# EAGLE design atmel-atmega328p-led-strip-controller (EAGLE 9.2.2)
CREVISION: 1.0; DESIGNER: Mate Horvath

## Sheet 1 of 2
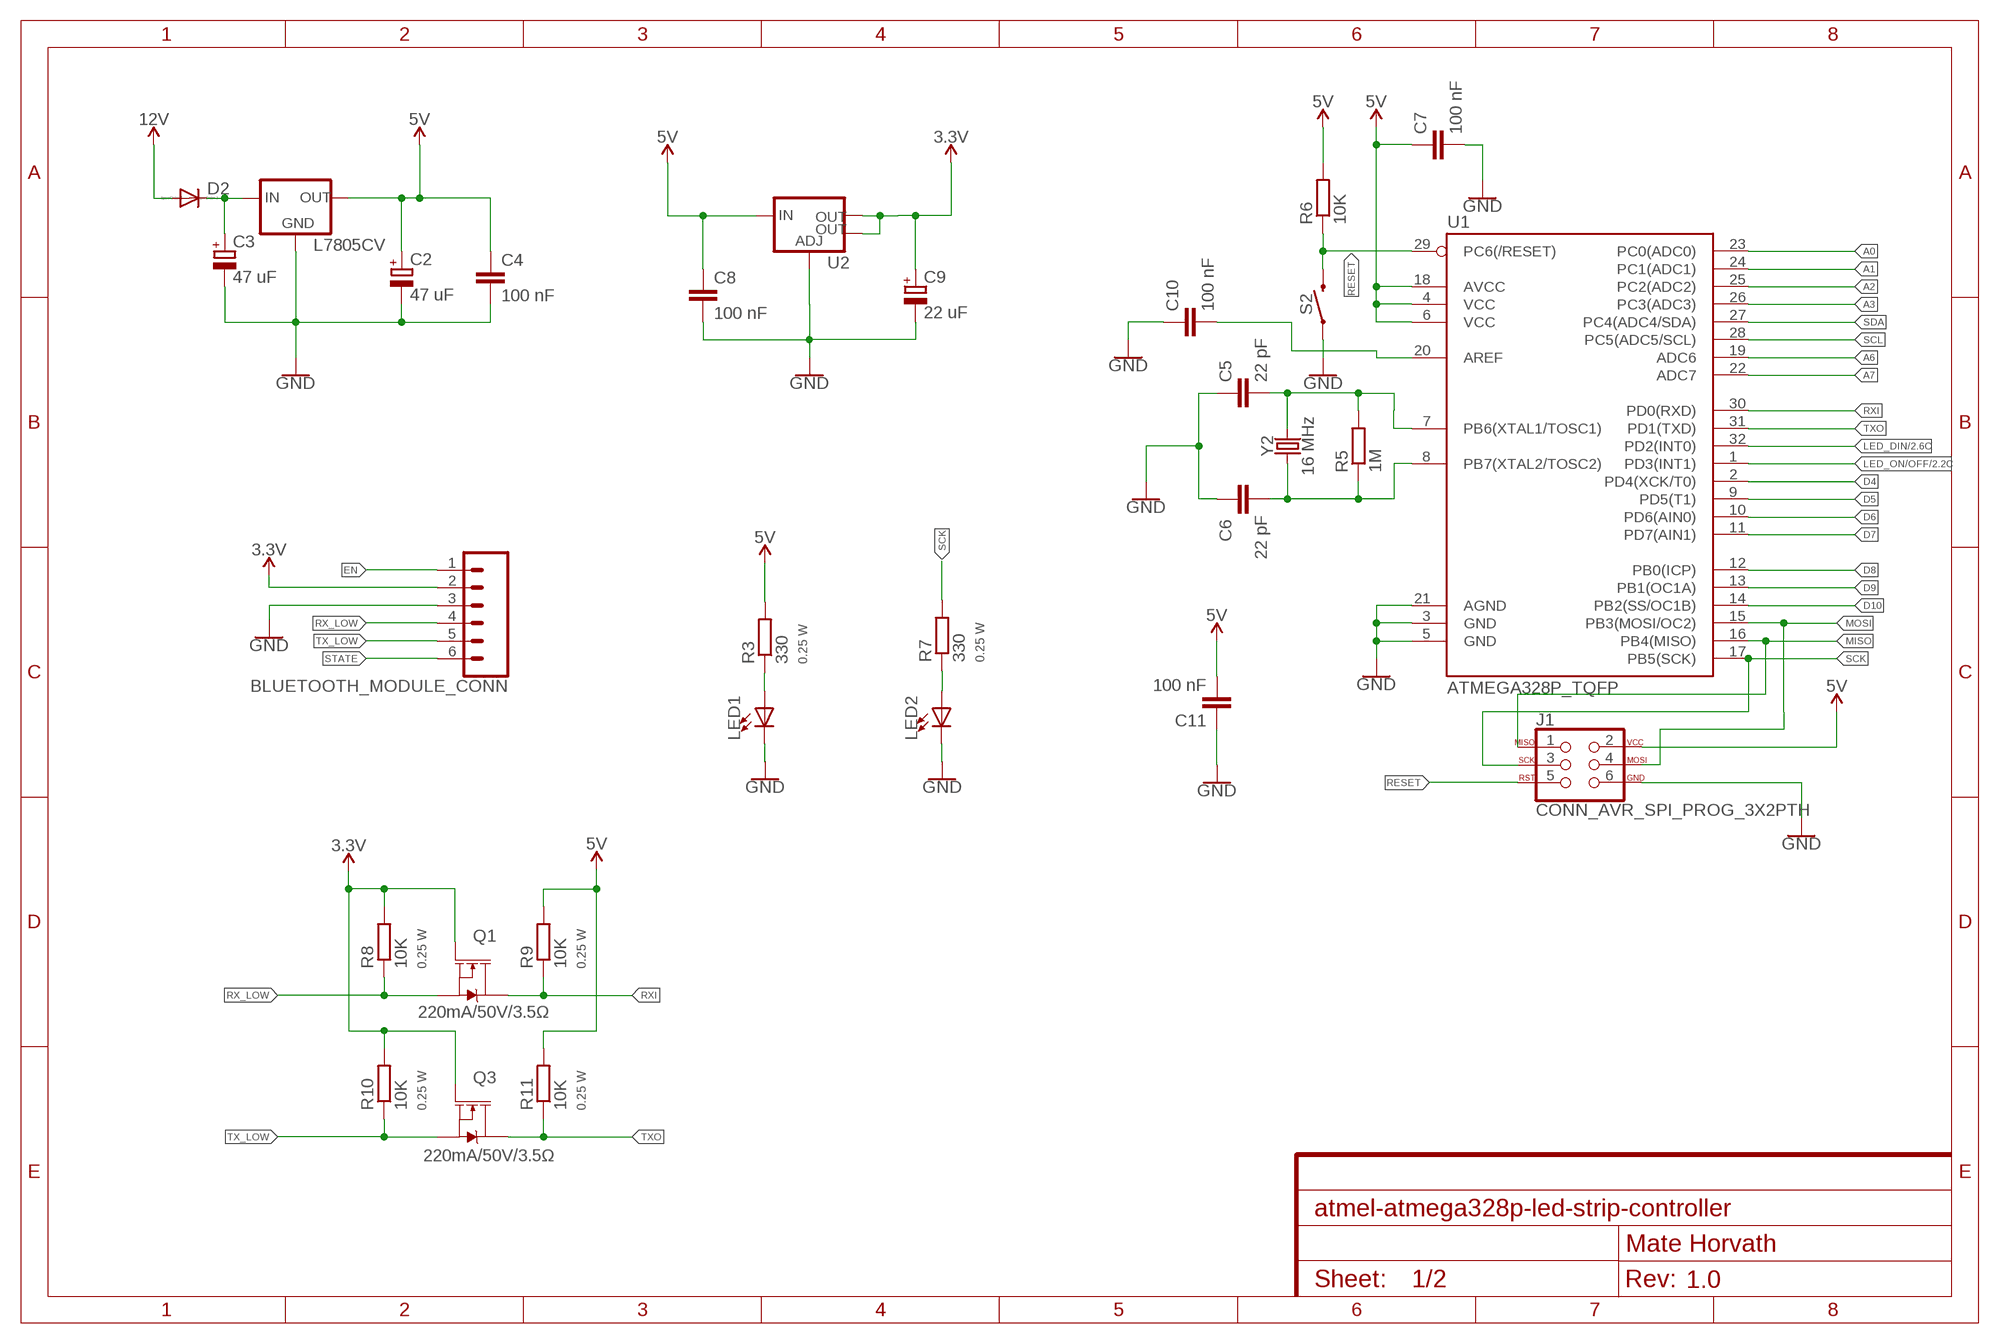
[diagram p0: schematic, sheet 1]

### Parts
BLUETOOTH_MODULE_CONN  CONN_06SILK_FEMALE_PTH  [1X06]
C2  47 uF  CAPACITOR_POLARIZEDE2.5-5  [E2,5-5]
C3  47 uF  CAPACITOR_POLARIZEDE2.5-5  [E2,5-5]
C4  100 nF  CAPACITOR_1C1206  [C1206I-C3216M]
C5  22 pF  CAPACITOR_1C1206  [C1206I-C3216M]
C6  22 pF  CAPACITOR_1C1206  [C1206I-C3216M]
C7  100 nF  CAPACITOR_1C1206  [C1206I-C3216M]
C8  100 nF  CAPACITOR_1C1206  [C1206I-C3216M]
C9  22 uF  CAPACITOR_POLARIZED153CLV-0505  [153CLV-0505]
C10  100 nF  CAPACITOR_1C1206  [C1206I-C3216M]
C11  100 nF  CAPACITOR_1C1206  [C1206I-C3216M]
D2  DIODED-10  [D-10]
J1  CONN_AVR_SPI_PROG_3X2PTH  [2X3_S]
L7805CV  V_REG_78XX_STANDING  [78XXS]
LED1  LEDCHIPLED_1206_G  [LED_1206_G]
LED2  LEDCHIPLED_1206_G  [LED_1206_G]
Q1  220mA/50V/3.5Ω  MOSFET_NCHN_SMD-BSS138  [SOT23-3]
Q3  220mA/50V/3.5Ω  MOSFET_NCHN_SMD-BSS138  [SOT23-3]
R3  330  RESISTORR1206  [R1206]
R5  1M  RESISTORR1206  [R1206]
R6  10K  RESISTORR1206  [R1206]
R7  330  RESISTORR1206  [R1206]
R8  10K  RESISTORR1206  [R1206]
R9  10K  RESISTORR1206  [R1206]
R10  10K  RESISTORR1206  [R1206]
R11  10K  RESISTORR1206  [R1206]
S2  INPUT_MOMENTARY_SWITCH_SPST-SMD-5.2MM  [TACTILE_SWITCH_SMD_5.2MM]
U1  ATMEGA328P_TQFP  MCU_ATMEGA328P_TQFP  [TQFP32-08]
U2  V_REG_LM1117SOT223  [SOT223]
Y2  16 MHz  CRYSTALSMD-3.2X2.5  [CRYSTAL-SMD-3.2X2.5MM]

### Nets
3.3V: BLUETOOTH_MODULE_CONN.2 C9.+ Q1.1(G) Q3.1(G) R8.2 R10.2 U2.2(OUT) U2.4(OUT)
5V: C2.+ C4.1 C7.1 C8.1 C11.2 J1.2 L7805CV.OUT R3.2 R6.2 R9.2 R11.2 U1.4(VCC) U1.6(VCC) U1.18(AVCC) U2.3(IN) ; also sheet 2
12V: D2.A ; also sheet 2
A0: U1.23(PC0(ADC0))
A1: U1.24(PC1(ADC1))
A2: U1.25(PC2(ADC2))
A3: U1.26(PC3(ADC3))
A6: U1.19(ADC6)
A7: U1.22(ADC7)
D4: U1.2(PD4(XCK/T0))
D5: U1.9(PD5(T1))
D6: U1.10(PD6(AIN0))
D7: U1.11(PD7(AIN1))
D8: U1.12(PB0(ICP))
D9: U1.13(PB1(OC1A))
D10: U1.14(PB2(SS/OC1B))
EN: BLUETOOTH_MODULE_CONN.1
GND: BLUETOOTH_MODULE_CONN.3 C2.- C3.- C4.2 C5.1 C6.1 C7.2 C8.2 C9.- C10.1 C11.1 J1.6 L7805CV.GND LED1.C LED2.C S2.1 U1.3(GND) U1.5(GND) U1.21(AGND) U2.1(ADJ) ; also sheet 2
LED_DIN: U1.32(PD2(INT0)) ; also sheet 2
LED_ON/OFF: U1.1(PD3(INT1)) ; also sheet 2
MISO: J1.1 U1.16(PB4(MISO))
MOSI: J1.4 U1.15(PB3(MOSI/OC2))
N$2: C5.2 R5.2 U1.7(PB6(XTAL1/TOSC1)) Y2.3
N$3: C6.2 R5.1 U1.8(PB7(XTAL2/TOSC2)) Y2.1
N$8: C10.2 U1.20(AREF)
N$11: LED1.A R3.1
N$12: C3.+ D2.C L7805CV.IN
N$13: LED2.A R7.1
RESET: J1.5 R6.1 S2.3 U1.29(PC6(/RESET))
RX_LOW: BLUETOOTH_MODULE_CONN.4 Q1.2(S) R8.1
RXI: Q1.3(D) R9.1 U1.30(PD0(RXD))
SCK: J1.3 R7.2 U1.17(PB5(SCK))
SCL: U1.28(PC5(ADC5/SCL))
SDA: U1.27(PC4(ADC4/SDA))
STATE: BLUETOOTH_MODULE_CONN.6
TX_LOW: BLUETOOTH_MODULE_CONN.5 Q3.2(S) R10.1
TXO: Q3.3(D) R11.1 U1.31(PD1(TXD))

## Sheet 2 of 2
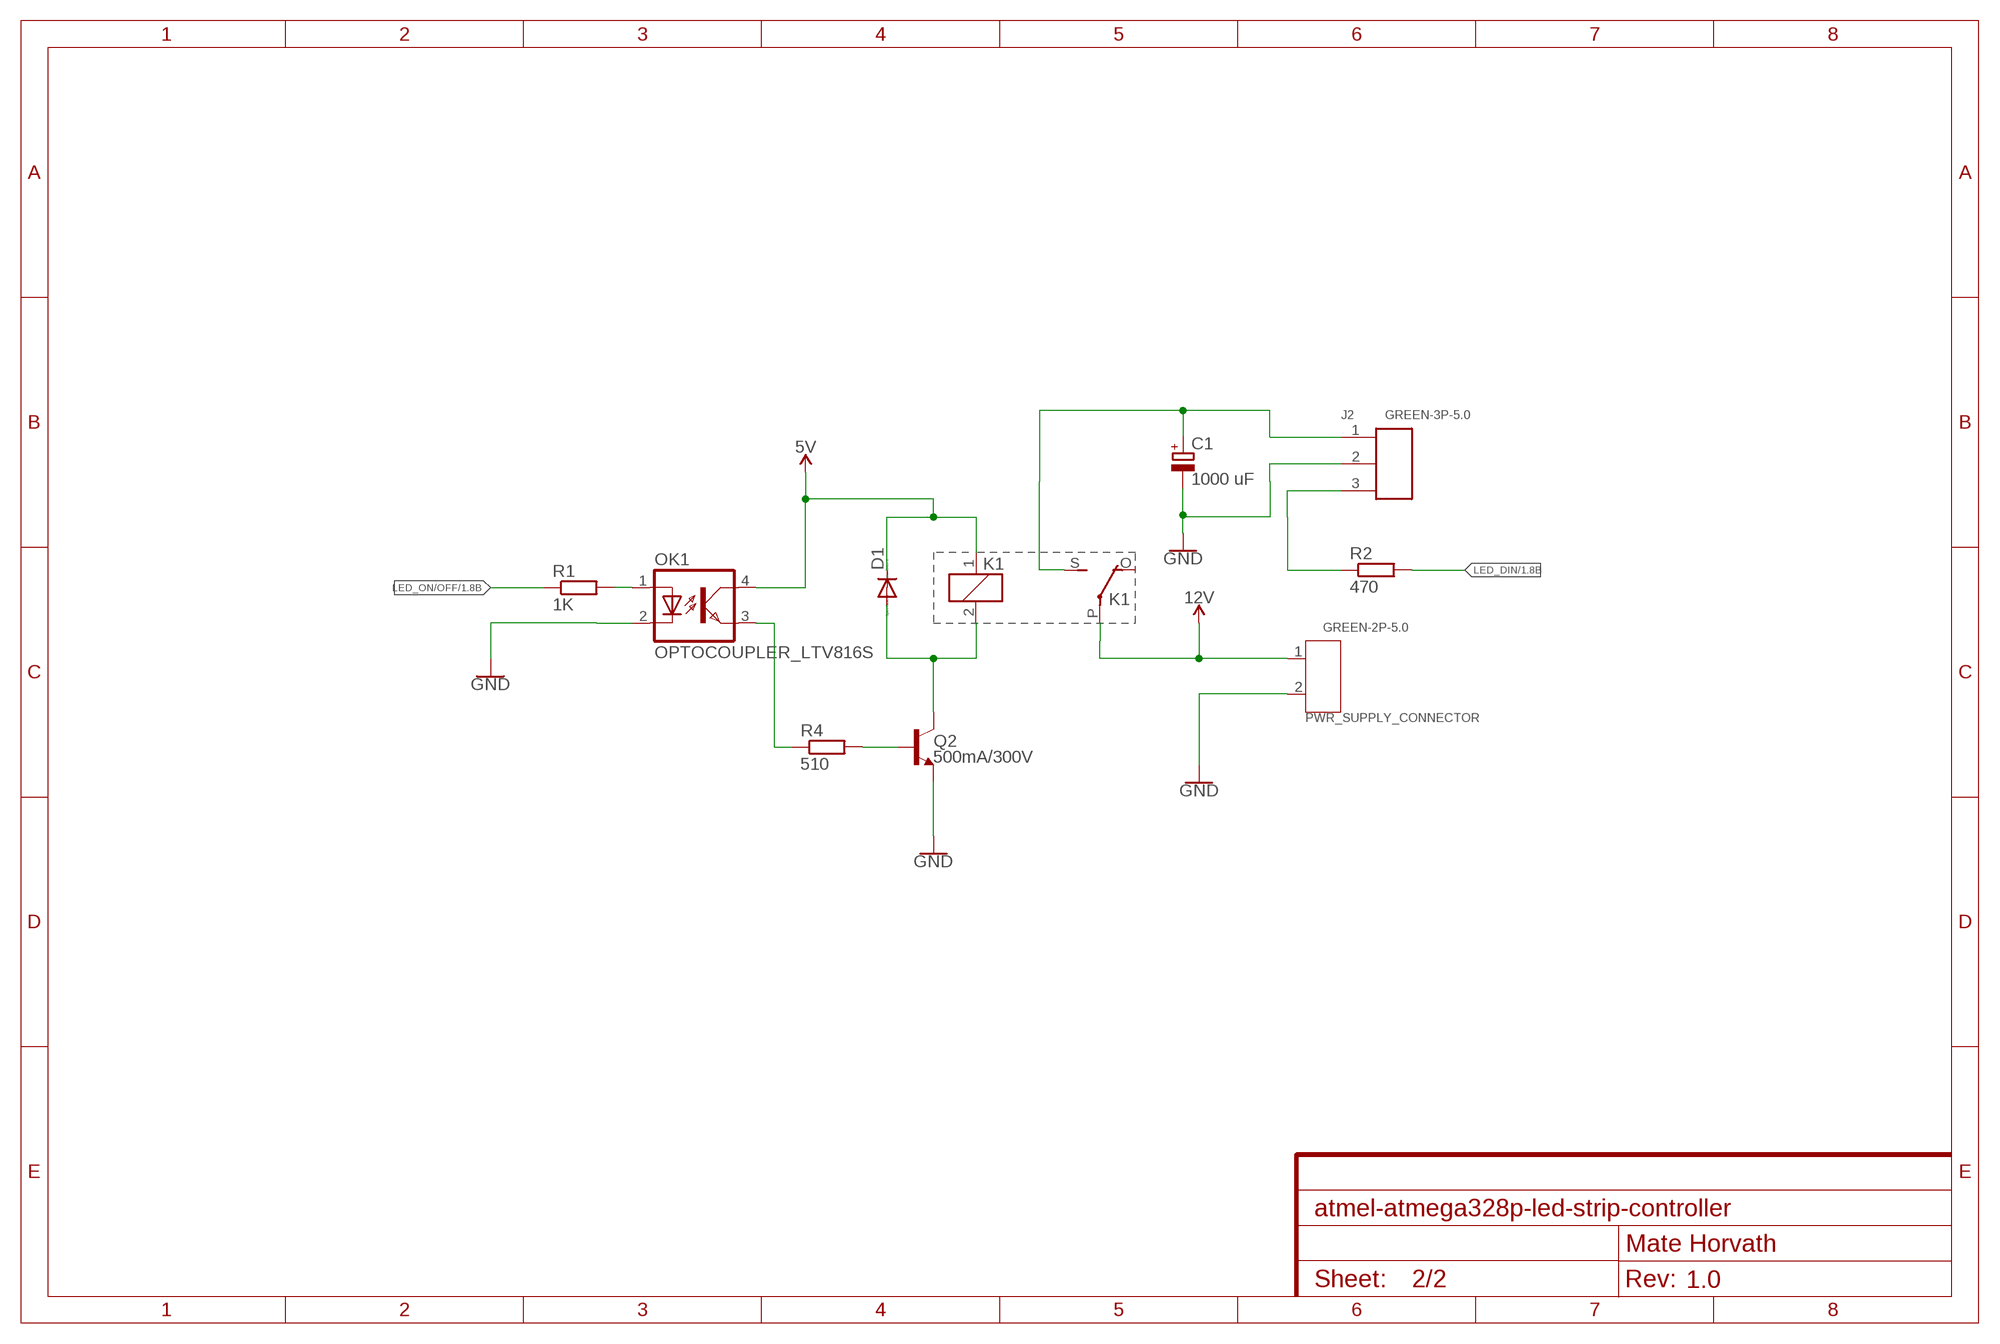
[diagram p1: schematic, sheet 2]

### Parts
C1  1000 uF  CAPACITOR_POLARIZEDE5-13  [E5-13]
D1  DIODED-10  [D-10]
J2  GREEN-3P-5.0  SCREW-TERMINAL-GREEN(3P-5.0)  [H3-5.0-15.5X8.0MM]
K1  RELAY_ZF112  [ZF112]
OK1  OPTOCOUPLER_LTV816S  [DIL4-SMD]
PWR_SUPPLY_CONNECTOR  GREEN-2P-5.0  SCREW-TERMINAL-GREEN(2P-5.0)  [H2-5.0-10.5X8.0MM]
Q2  500mA/300V  TRAN_NPN-MMBTA42  [SOT23-3]
R1  1K  RESISTORR1206  [R1206]
R2  470  RESISTORR1206  [R1206]
R4  510  RESISTORR1206  [R1206]

### Nets
5V: D1.C K1.1 OK1.4(COL) ; also sheet 1
12V: K1.P(2:P) PWR_SUPPLY_CONNECTOR.1 ; also sheet 1
GND: C1.- J2.2 OK1.2(C) PWR_SUPPLY_CONNECTOR.2 Q2.2(E) ; also sheet 1
LED_DIN: R2.2 ; also sheet 1
LED_ON/OFF: R1.1 ; also sheet 1
N$1: J2.3 R2.1
N$4: D1.A K1.2 Q2.3(C)
N$5: OK1.1(A) R1.2
N$6: Q2.1(B) R4.2
N$7: OK1.3(EMIT) R4.1
N$9: C1.+ J2.1 K1.S(2:S)
Unconnected: K1.O(2:O)

## Library data of the parts
BLUETOOTH_MODULE_CONN = 001-private-inventory:CONN_06: Multi connection point. Often used as Generic Header-pin footprint for 0.1 inch spaced/style header connections On any of the 0.1 inch spaced packages, you can populate with these: Break Away Headers - Straight <https://www.sparkfun.com/products/116> (PRT-00116) Break Away Male Headers - Right Angle <https://www.sparkfun.com/products/553> (PRT-00553) Female Headers <https://www.sparkfun.com/products/115> (PRT-00115) Break Away Headers - Machine Pin <https://www.sparkfun.com/products/117> (PRT-00117) Break Away Female Headers - Swiss Machine Pin <https://www.sparkfun.com/products/743> (PRT-00743) Arduino Stackable Header - 6 Pin <https://www.sparkfun.com/products/9280> (PRT-09280) For SCREWTERMINALS and SPRING TERMINALS visit here: Screw Terimnals on SparkFun.com <https://www.sparkfun.com/search/results?term=Screw+Terminals> (5mm/3.5mm/2.54mm spacing) This device is also useful as a general connection point to wire up your design to another part of your project. Our various solder wires solder well into these plated through hole pads. Hook-Up Wire - Assortment (Stranded, 22 AWG) <https://www.sparkfun.com/products/11375> (PRT-11375) Hook-Up Wire - Assortment (Solid Core, 22 AWG) <https://www.sparkfun.com/products/11367> (PRT-11367) View the entire wire category on our website here <https://www.sparkfun.com/categories/141>; PROD_ID: CONN-08437
C1-C3 C9 = 006-rcl:CAPACITOR_POLARIZED: POLARIZED CAPACITOR, European symbol; SPICEPREFIX: C
C4-C8 C10 C11 = 006-rcl:CAPACITOR_1: CAPACITOR, European symbol; SPICEPREFIX: C
D1 D2 = 13-diode:DIODE: DIODE
J1 = 007-connectors:CONN_AVR_SPI_PROG_3X2: AVR ISP 6 Pin This is the reduced ISP connector for AVR programming. Common on Arduino. This footprint will take up less PCB space and can be used with a 10-pin to 6-pin adapter such as SKU: BOB-08508 **Special note about "TEST_POINT" package. The stop mask is on the top side, so if you want your programming test points to be on the bottom of your board, make sure to place this package on the bottom side of the board. This also ensure that the orientation to program from the bottom side will be correct. SparkFun Products: SparkFun ISP Pogo Adapter <https://www.sparkfun.com/products/11591> - NS Tiny AVR Programmer <https://www.sparkfun.com/products/11801> -PTH
J2 = 007-connectors:SCREW-TERMINAL-GREEN(3P-5.0): 320110029
K1 = 001-private-inventory:RELAY_ZF112: RELAY 1 x switch; OC_FARNELL: unknown; OC_NEWARK: unknown
L7805CV = 11-voltage-regulator:V_REG_78XX_STANDING: VOLTAGE REGULATOR
LED1 LED2 = 009-led:LED: LED OSRAM: - CHIPLED LG R971, LG N971, LY N971, LG Q971, LY Q971, LO R971, LY R971 LH N974, LH R974 LS Q976, LO Q976, LY Q976 LO Q996 - Hyper CHIPLED LW Q18S LB Q993, LB Q99A, LB R99A - SideLED LS A670, LO A670, LY A670, LG A670, LP A670 LB A673, LV A673, LT A673, LW A673 LH A674 LY A675 LS A676, LA A676, LO A676, LY A676, LW A676 LS A679, LY A679, LG A679 - Hyper Micro SIDELED® LS Y876, LA Y876, LO Y876, LY Y876 LT Y87S - SmartLED LW L88C, LW L88S LB L89C, LB L89S, LG L890 LS L89K, LO L89K, LY L89K LS L896, LA L896, LO L896, LY L896 - TOPLED LS T670, LO T670, LY T670, LG T670, LP T670 LSG T670, LSP T670, LSY T670, LOP T670, LYG T670 LG T671, LOG T671, LSG T671 LB T673, LV T673, LT T673, LW T673 LH T674 LS T676, LA T676, LO T676, LY T676, LB T676, LH T676, LSB T676, LW T676 LB T67C, LV T67C, LT T67C, LS T67K, LO T67K, LY T67K, LW E67C LS E67B, LA E67B, LO E67B, LY E67B, LB E67C, LV E67C, LT E67C LW T67C LS T679, LY T679, LG T679 LS T770, LO T770, LY T770, LG T770, LP T770 LB T773, LV T773, LT T773, LW T773 LH T774 LS E675, LA E675, LY E675, LS T675 LS T776, LA T776, LO T776, LY T776, LB T776 LHGB T686 LT T68C, LB T68C - Hyper Mini TOPLED® LB M676 - Mini TOPLED Santana® LG M470 LS M47K, LO M47K, LY M47K Source: http://www.osram.convergy.de LUXEON: - LUMILED® LXK2-PW12-R00, LXK2-PW12-S00, LXK2-PW14-U00, LXK2-PW14-V00 LXK2-PM12-R00, LXK2-PM12-S00, LXK2-PM14-U00 LXK2-PE12-Q00, LXK2-PE12-R00, LXK2-PE12-S00, LXK2-PE14-T00, LXK2-PE14-U00 LXK2-PB12-K00, LXK2-PB12-L00, LXK2-PB12-M00, LXK2-PB14-N00, LXK2-PB14-P00, LXK2-PB14-Q00 LXK2-PR12-L00, LXK2-PR12-M00, LXK2-PR14-Q00, LXK2-PR14-R00 LXK2-PD12-Q00, LXK2-PD12-R00, LXK2-PD12-S00 LXK2-PH12-R00, LXK2-PH12-S00 LXK2-PL12-P00, LXK2-PL12-Q00, LXK2-PL12-R00 Source: www.luxeon.com KINGBRIGHT: KA-3528ASYC Source: www.kingbright.com
OK1 = 001-private-inventory:OPTOCOUPLER_LTV816: OPTO COUPLER Source: LITEON, LTV816.pdf
PWR_SUPPLY_CONNECTOR = 007-connectors:SCREW-TERMINAL-GREEN(2P-5.0): 320110031
Q1 Q3 = 001-private-inventory:MOSFET_NCHN_SMD: N-channel MOSFETs Voltage controlled devices that allow control of high current outputs. SparkFun Products: SparkFun OpenScale <https://www.sparkfun.com/products/13261> SparkFun Digital Sandbox <https://www.sparkfun.com/products/12651> SparkFun Monster Moto Shield <https://www.sparkfun.com/products/10182> SparkFun MOSFET Power Controller <https://www.sparkfun.com/products/11214>; PROD_ID: TRANS-00830
Q2 = 12-transistors:TRAN_NPN: NPN transistor Current controlled devices typically used to amplify current or used as a switch. BC547 - COM-08928 <http://www.sparkfun.com/products/8928> (TO-92 45V 100mA) (1.Collector 2.Base 3.Emitter) 2N3904 - COM-00521 <http://www.sparkfun.com/products/521> (TO-92 40V 200mA) (1.Emitter 2.Base 3.Collector) P2N2222A - COM-12852 <http://www.sparkfun.com/products/12852> (TO-92 40V 600mA) (1.Collector 2.Base 3.Emitter); PROD_ID: TRANS-09116
R1-R11 = 001-private-inventory:RESISTOR: RESISTOR, European symbol; POWER: 0.25 W; SPICEPREFIX: R
S2 = 010-inputs:INPUT_MOMENTARY_SWITCH_SPST: Momentary Switch (Pushbutton) - SPST Normally-open (NO) SPST momentary switches (buttons, pushbuttons). Variants PTH-12MM - 12mm square, through-hole Momentary Pushbutton Switch - 12mm Square <https://www.sparkfun.com/products/9190> (COM-09190) PTH-6.0MM, PTH-6.0MM-KIT - 6.0mm square, through-hole Mini Pushbutton Switch <https://www.sparkfun.com/products/97> (COM-00097) KIT package intended for soldering kit's - only one side of pads' copper is exposed. PTH-RIGHT-ANGLE-KIT - Right-angle, through-hole Right Angle Tactile Button <https://www.sparkfun.com/products/10791> - Used on SparkFun BigTime Watch Kit <https://www.sparkfun.com/products/11734> SMD-12MM - 12mm square, surface-mount Tactile Button - SMD (12mm) <https://www.sparkfun.com/products/12993> (COM-12993) Used on SparkFun PicoBoard <https://www.sparkfun.com/products/11888> SMD-4.5MM - 4.5mm Square Trackball Switch Used on SparkFun Blackberry Trackballer Breakout <https://www.sparkfun.com/products/13169> SMD-4.6MMX2.8MM - 4.60mm x 2.80mm, surface mount Used on SparkFun SAMD21 Mini Breakout <https://www.sparkfun.com/products/13664> SMD-5.2MM, SMD-5.2-REDUNDANT - 5.2mm square, surface-mount Mini Pushbutton Switch - SMD <https://www.sparkfun.com/products/8720> (COM-08720) Used on Arduino Pro Mini <https://www.sparkfun.com/products/11114> REDUNDANT package connects both switch circuits together SMD-6.0X3.5MM - 6.0 x 3.5mm, surface mount Momentary Reset Switch SMD <https://www.sparkfun.com/products/8229> (COM-08229) SMD-6.2MM-TALL - 6.2mm square, surface mount Tactile Button - SMD (6mm) <https://www.sparkfun.com/products/12992> Used on SparkFun Digital Sandbox <https://www.sparkfun.com/products/12651> SMD-RIGHT-ANGLE - Right-angle, surface mount Used on SparkFun Block for Intel® Edison - Arduino <https://www.sparkfun.com/products/13036>; PROD_ID: SWCH-08247; SF_SKU: COM-08720
U1 = 008-mcu:MCU_ATMEGA328P_TQFP: Popular 328P in QFP Storefront component: ATmega328 - TQFP <https://www.sparkfun.com/products/13448> (COM-13448) Datasheet <http://www.sparkfun.com/datasheets/Components/SMD/ATMega328.pdf> SparkFun Products SparkFun RedBoard - Programmed with Arduino <https://www.sparkfun.com/products/12757> (DEV-12757) Arduino Pro Mini 328 - 5V/16MHz <https://www.sparkfun.com/products/11113> (DEV-11113) Arduino Pro Mini 328 - 3.3V/8MHz <https://www.sparkfun.com/products/11114> (DEV-11114) SparkFun OpenLog <https://www.sparkfun.com/products/13712> (DEV-13712) SparkFun MicroView - OLED Arduino Module <https://www.sparkfun.com/products/12923> (DEV-12923) SparkFun Digital Sandbox <https://www.sparkfun.com/products/12651> (DEV-12651) SparkFun PicoBoard <https://www.sparkfun.com/products/11888> (WIG-11888) Arduino Fio <https://www.sparkfun.com/products/10116> (DEV-10116) LilyPad Arduino 328 Main Board <https://www.sparkfun.com/products/13342> (DEV-13342) SparkFun RedStick <https://www.sparkfun.com/products/13741> (DEV-13741) LilyPad MP3 <https://www.sparkfun.com/products/11013> (DEV-11013) LilyPad Arduino SimpleSnap <https://www.sparkfun.com/products/10941> (DEV-10941) SparkFun Stepoko <https://www.sparkfun.com/products/13899> (ROB-13899) SparkFun Geiger Counter <https://www.sparkfun.com/products/11345> (SEN-11345) SparkFun EL Sequencer <https://www.sparkfun.com/products/12781> (COM-12781) Arduino Pro 328 - 5V/16MHz <https://www.sparkfun.com/products/10915> (DEV-10915) CryptoCape <https://www.sparkfun.com/products/12773> (DEV-12773) SparkFun IR Thermometer Evaluation Board - MLX90614 <https://www.sparkfun.com/products/10740> (SEN-10740) SparkFun RedBot Mainboard <https://www.sparkfun.com/products/12097> (ROB-12097) Arduino Pro 328 - 3.3V/8MHz <https://www.sparkfun.com/products/10914> (DEV-10914) SparkFun Block for Intel® Edison - Arduino <https://www.sparkfun.com/products/13036> (DEV-13036) SparkFun Simon Says - Surface Mount Soldering Kit <https://www.sparkfun.com/products/10935> (KIT-10935) SparkFun 7-Segment Serial Display - Red <https://www.sparkfun.com/products/11441> (COM-11441) SparkFun 7-Segment Serial Display - White <https://www.sparkfun.com/products/11629> (COM-11629) SparkFun 7-Segment Serial Display - Yellow <https://www.sparkfun.com/products/11443> (COM-11443) SparkFun 7-Segment Serial Display - Kelly Green <https://www.sparkfun.com/products/11440> (COM-11440) SparkFun 7-Segment Serial Display - Blue <https://www.sparkfun.com/products/11442> (COM-11442) SparkFun OpenSegment Serial Display - 20mm (Blue) <https://www.sparkfun.com/products/11647> (COM-11647) SparkFun OpenSegment Serial Display - 20mm (Green) <https://www.sparkfun.com/products/11646> (COM-11646) SparkFun OpenSegment Serial Display - 20mm (White) <https://www.sparkfun.com/products/11648> (COM-11648) SparkFun OpenSegment Serial Display - 20mm (Red) <https://www.sparkfun.com/products/11644> (COM-11644) SparkFun OpenSegment Serial Display - 20mm (Yellow) <https://www.sparkfun.com/products/11645> (COM-11645) SparkFun OpenSegment Shield <https://www.sparkfun.com/products/13190> (DEV-13190); PROD_ID: IC-09069
U2 = 11-voltage-regulator:V_REG_LM1117: Voltage Regulator LM1117 Standard adjustable voltage regulator but in SMD form. Spark Fun Electronics SKU : COM-00595; PROD_ID: VREG-08170
Y2 = 001-private-inventory:CRYSTAL: Crystals (Generic) These are passive quartz crystals, which can be used as a clock source for a microcontroller. Crystal's are two-terminal devices. They require external "load" capacitors to generate an oscillating signal.

## Board
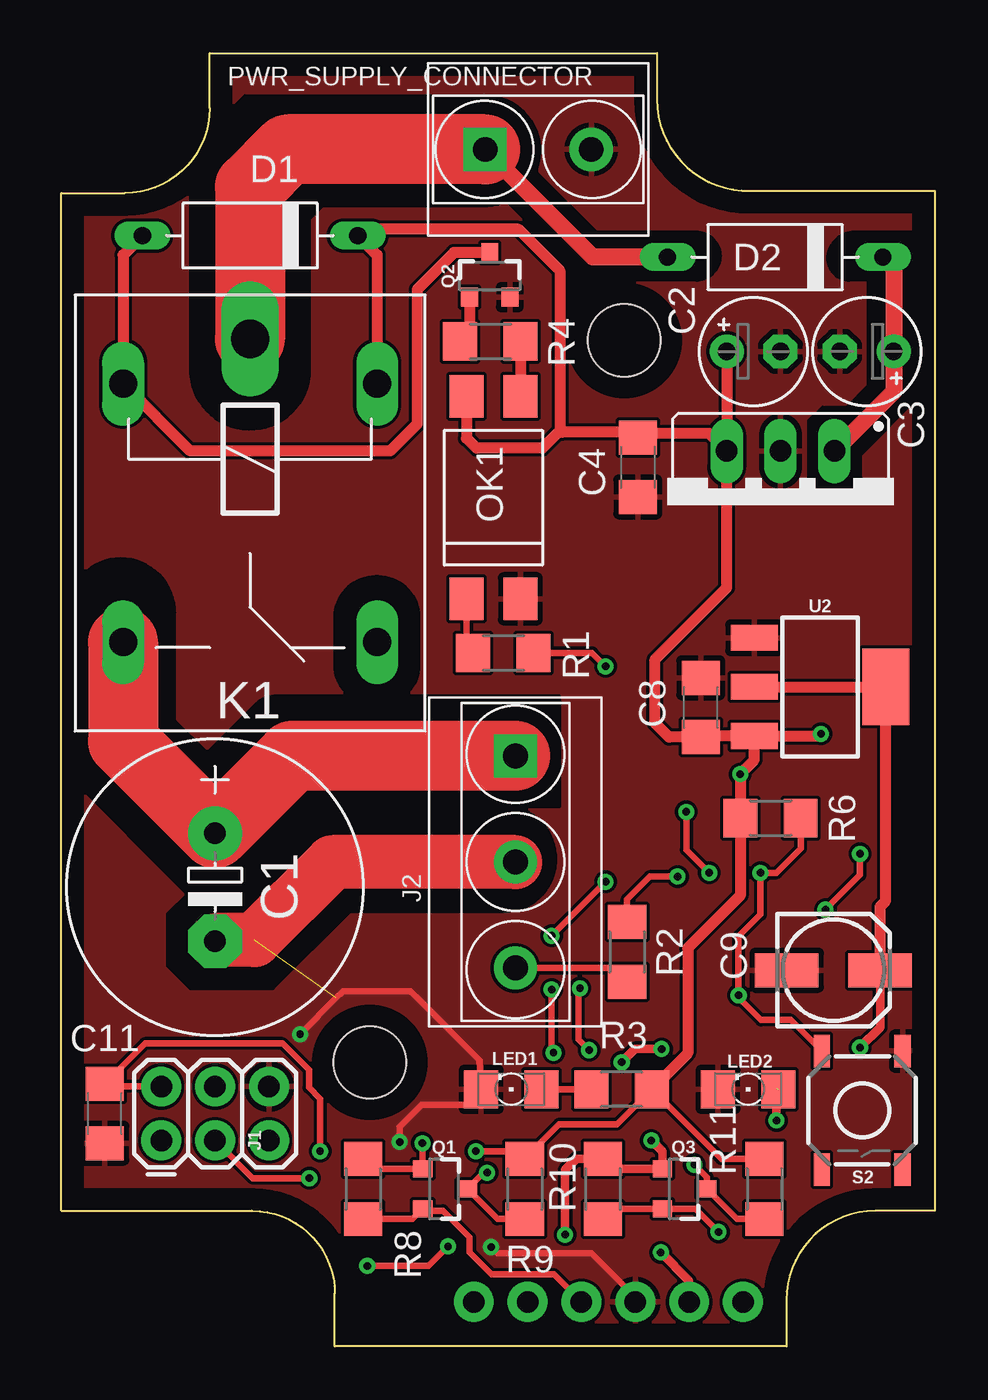
[diagram p2: board, top side]
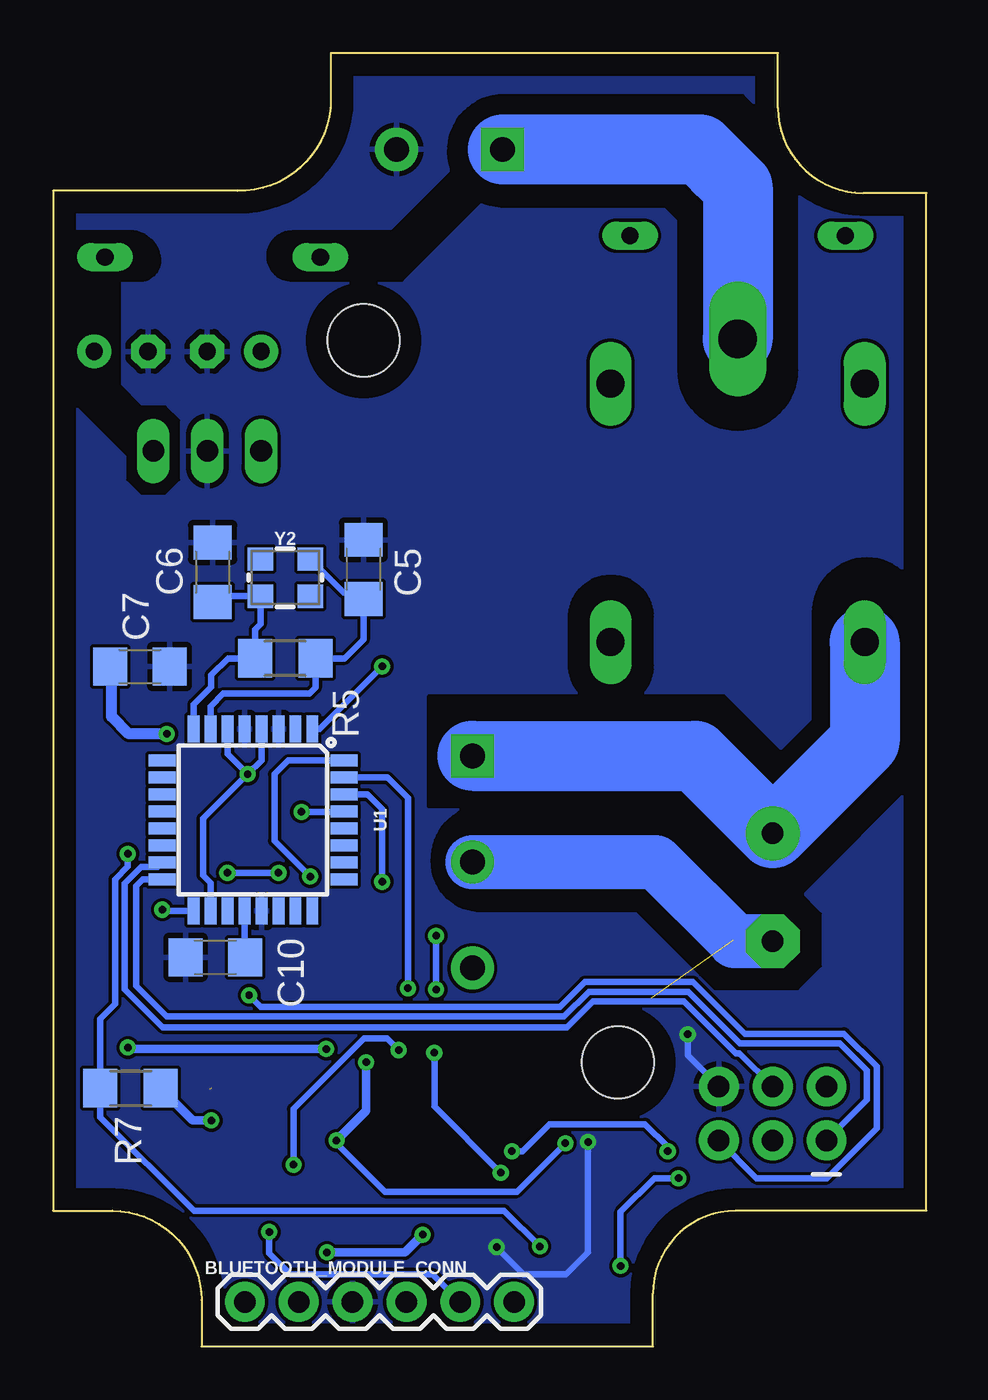
[diagram p3: board, bottom side, seen from below]

Size 41.2 x 61 mm. Coordinates in mm from the lower left corner, seen from the top.
Outline: 0,6.4 9,6.4 arc-90 12.9,2.5 12.9,0 34.2,0 34.2,2.2 arc-90 38.4,6.4 41.2,6.4 41.2,54.5 32.5,54.5 arc-91 28.1,58.8 28.1,61 7,61 7,58.4 arc-90 3,54.4 0,54.4 0,6.4
Copper layers (1*16): Top 0.035mm / dielectric 1.5mm / Bottom 0.035mm
Design rules "default": minimum track width 6mil, minimum drill 0.35mm, track to track 6mil, track to pad 6mil, pad to pad 6mil, via to via 6mil, smd to smd 6mil, copper to edge 40mil, drill to drill 6mil, minimum pad ring 10mil, minimum via ring 8mil, stop-mask expansion 4mil, vias tented up to drill 0mil, thermal gap 10mil
Holes 3.4 mm at 14.55,13.4 26.55,47.45

### Footprints (pad centres in the part's own frame; a part is rotated, then mirrored left to right if it is on the bottom)
1X06 = drill 1.016 pad 1.88: 1 0,0; 2 2.54,0; 3 5.08,0; 4 7.62,0; 5 10.16,0; 6 12.7,0
E5-13 = drill 1.016 pad 2.54: + -2.54,0 | drill 1.016 pad 2.54 octagon: - 2.54,0
E2,5-5 = drill 0.813 pad 1.6: + -1.27,0 | drill 0.813 pad 1.6 octagon: - 1.27,0
C1206I-C3216M = smd 1.6 x 1.8: 1 -1.4,0; 2 1.4,0
153CLV-0505 = smd 3 x 1.6: + 2.2,0; - -2.2,0
D-10 = drill 0.813 long: A 5.08,0; C -5.08,0
2X3_S = drill 1.016 pad 1.88: 1 0,0; 2 0,2.54; 3 2.54,0; 4 2.54,2.54; 5 5.08,0; 6 5.08,2.54
H3-5.0-15.5X8.0MM = drill 1.168 pad 2.032 square: 1 0,5 | drill 1.168 pad 2.032: 2 0,0; 3 0,-5
ZF112 = drill 1.321 long: 1 -6.096,5.994; 2 -6.096,-5.994; O 6.096,5.994; S 6.096,-5.994 | drill 1.803 long: P -8.204,0
78XXS = drill 1.016 long: GND 0,-2.54; IN -2.54,-2.54; OUT 2.54,-2.54
LED_1206_G = smd 1.6 x 1.803: A -1.422,0; C 1.422,0
DIL4-SMD = smd 1.6 x 2: 1 -1.27,-4.77; 2 1.27,-4.77; 3 1.27,4.77; 4 -1.27,4.77
H2-5.0-10.5X8.0MM = drill 1.168 pad 2.032 square: 1 0,2.5 | drill 1.168 pad 2.032: 2 0,-2.5
SOT23-3 = smd 0.8 x 0.9: 1 -0.95,-1; 2 0.95,-1; 3 0,1.1
R1206 = smd 1.6 x 1.803: 1 -1.422,0; 2 1.422,0
TACTILE_SWITCH_SMD_5.2MM = smd 1.524 x 0.762: 1 -2.794,1.905; 2 2.794,1.905; 3 -2.794,-1.905; 4 2.794,-1.905
TQFP32-08 = smd 1.27 x 0.559: 1 -4.293,2.8; 2 -4.293,2; 3 -4.293,1.2; 4 -4.293,0.4; 5 -4.293,-0.4; 6 -4.293,-1.2; 7 -4.293,-2; 8 -4.293,-2.8; 17 4.293,-2.8; 18 4.293,-2; 19 4.293,-1.2; 20 4.293,-0.4; 21 4.293,0.4; 22 4.293,1.2; 23 4.293,2; 24 4.293,2.8 | smd 0.559 x 1.27: 9 -2.8,-4.293; 10 -2,-4.293; 11 -1.2,-4.293; 12 -0.4,-4.293; 13 0.4,-4.293; 14 1.2,-4.293; 15 2,-4.293; 16 2.8,-4.293; 25 2.8,4.293; 26 2,4.293; 27 1.2,4.293; 28 0.4,4.293; 29 -0.4,4.293; 30 -1.2,4.293; 31 -2,4.293; 32 -2.8,4.293
SOT223 = smd 1.219 x 2.235: 1 -2.311,-3.099; 2 0,-3.099; 3 2.311,-3.099 | smd 3.6 x 2.2: 4 0,3.099
CRYSTAL-SMD-3.2X2.5MM = smd 1.2 x 1.1: 1 -1.175,-0.875; 2 1.175,-0.875; 3 1.175,0.875; 4 -1.175,0.875

### Placement (x,y rotation side)
BLUETOOTH_MODULE_CONN  32.15,2.1 0 bottom
C1  7.26,21.66 270 top
C2  32.66,46.93 0 top
C3  37.99,46.93 180 top
C4  27.19,41.47 270 top
C5  26.56,36.64 270 bottom
C6  33.67,36.52 270 bottom
C7  37.1,32.07 0 bottom
C8  30.16,30.13 90 top
C9  36.42,17.74 0 top
C10  33.54,18.35 0 bottom
C11  2.05,10.99 90 top
D1  8.91,52.39 180 top
D2  33.67,51.37 180 top
J1  4.72,9.72 0 top
J2  21.42,22.85 0 top
K1  8.91,39.31 270 top
L7805CV  33.92,39.69 180 top
LED1  21.23,12.13 180 top
LED2  32.4,12.13 180 top
OK1  20.38,40.03 0 top
PWR_SUPPLY_CONNECTOR  22.49,56.45 90 top
Q1  18.05,7.43 270 top
Q2  20.21,50.48 0 top
Q3  29.35,7.43 270 top
R1  20.84,32.7 180 top
R2  26.69,18.61 90 top
R3  26.43,12.13 0 top
R4  20.24,47.4 180 top
R5  30.24,32.45 0 bottom
R6  33.45,24.92 180 top
R7  37.55,12.18 180 bottom
R8  14.24,7.43 90 top
R9  21.86,7.43 90 top
R10  25.54,7.43 90 top
R11  33.16,7.43 90 top
S2  37.78,11.14 270 top
U1  31.77,24.83 270 bottom
U2  35.79,31.11 270 top
Y2  30.24,36.26 0 bottom

### Tracks (layer width: path | path; a pad name or v marks a point on that pad's centre or on a via)
3.3V  (via drill 0.35)
  Top 0.305: R8.2 14.71,8.38 Q1.1 17.05,9.57 v17.03,9.59 | 26.02,8.38 R10.2
  Top 0.406: 26.02,8.38 Q3.1 28.35,9.19 v27.83,9.72 | R10.2 24.3,8.85 23.77,8.32 v23.77,5.27 | v28.28,4.43 29.61,3.1 BLUETOOTH_MODULE_CONN.2 | v26.43,13.4 27.06,14.03 v28.32,14.03 | v37.67,14.1 38.62,15.05 C9.+
  Top 0.508: U2.2 U2.4 38.89,21.02 38.62,20.75 C9.+
  Bottom 0.305: v17.03,9.59 19.32,7.3 25.54,7.3 27.83,9.59 v27.83,9.72
  Bottom 0.406: v27.83,9.72 26.43,11.12 v26.43,13.4 | v23.77,5.27 24.6,4.43 v28.28,4.43 | v28.32,14.03 37.6,14.03 v37.67,14.1
5V  (via drill 0.35)
  Top 0.305: 23.39,43.06 23.58,43.06 23.64,43.12 23.51,43.12 | 27.38,43.06 C4.1 26.94,43.12 | R11.2 31.13,8.85 R3.2 26.2,10.48 23.49,10.48 21.97,8.97 | 21.97,8.97 R9.2 | v12.21,9.21 12.21,11.68 11.68,12.21 11.68,13.04 10.43,14.29 3.95,14.29 C11.2 2.18,12.26 J1.2 | v19.56,9.21 21.73,9.21 21.97,8.97
  Top 0.508: K1.1 14.9,51.48 D1.C 14.28,52.68 21.57,52.68 23.51,50.74 23.51,43.12 | 23.39,43.06 22.69,42.36 19.59,42.36 19.11,42.84 OK1.4 | C2.+ L7805CV.OUT | L7805CV.OUT 30.56,43.06 27.38,43.06 | 26.94,43.12 23.64,43.12 | U2.3 30.23,28.8 C8.1 28.67,28.73 28,29.4 28,32.4 31.38,35.78 L7805CV.OUT | U2.3 32.69,27.66 v32.02,26.99 R6.2 32.03,21.27 29.55,18.79 29.55,13.82 R3.2 | U2.3 35.73,28.8 v35.83,28.89
  Bottom 0.305: U1.4 31.37,27.64 v32.02,26.99 | v32.02,26.99 32.97,27.94 U1.6 | v19.56,9.21 19.07,9.21 17.79,10.48 13.27,10.48 12.21,9.42 v12.21,9.21 | U1.18 33.77,21.86 34.12,22.21 34.12,24.89 v32.02,26.99
  Bottom 0.508: v35.83,28.89 37.62,28.89 38.44,29.71 38.44,32.01 C7.1
12V
  Top 0.813: PWR_SUPPLY_CONNECTOR.1 25.08,51.37 D2.A
  Top 3.302: PWR_SUPPLY_CONNECTOR.1 10.68,56.45 8.91,54.68 K1.P
  Bottom 3.302: PWR_SUPPLY_CONNECTOR.1 10.68,56.45 9.8,55.57 8.91,54.68 K1.P
GND  (via drill 0.35)  (1 unrouted)
  Top 0.305: v15.96,9.64 15.96,10.36 17,11.4 18.99,11.4 LED1.C 19.73,13.5 16.91,16.31 16.47,16.75 13.3,16.75 12.97,16.43 v11.27,14.72 | v20.28,4.69 20.56,4.4 25,4.4 27.07,2.33 BLUETOOTH_MODULE_CONN.3
  Top 2.54: C1.- 7.3,19.17 9.11,19.17 12.79,22.85 J2.2
  Bottom 0.305: v15.96,9.64 15.96,4.44 17,3.4 19,3.4 20.28,4.68 v20.28,4.69 | J1.6 11.27,13.73 v11.27,14.72
  Bottom 2.54: J2.2 12.78,22.85 9.05,19.12 C1.-
  pour Top: 0.02,54.42 3.19,54.42 arc90 7,58.23 7,61.03 28.08,61.03 28.08,58.49 arc90 32.02,54.55 41.16,54.55 41.16,6.42 38.37,6.42 arc90 34.18,2.22 34.18,0.07 12.97,0.07 12.97,2.61 arc90 9.16,6.42 0.02,6.42
  pour Bottom: 0.02,54.42 0.02,6.42 9.16,6.42 arc-90 12.97,2.61 12.97,-0.06 arc-90 13.1,0.07 34.18,0.07 34.18,2.22 arc-90 38.37,6.42 41.16,6.42 41.16,54.55 32.27,54.55 arc-90 28.08,58.74 28.08,61.03 7,61.03 7,58.36 arc-90 3.06,54.42
  cutout Bottom: 0.27,26.99 0.27,34.61 arc-180 5.35,34.61 5.35,29.53 6.87,28.01 9.54,30.67 23.51,30.67 23.51,25.47 12.59,25.47 8.4,21.27 5.98,21.27
  cutout Bottom: 8.65,58.99 19.95,58.99 arc-183 19.83,53.79 12.34,53.79 11.7,53.15 11.7,46.04 arc-180 6.11,46.04 6.11,56.45
  cutout Top: 5.35,29.53 5.35,34.61 arc180 0.27,34.61 0.27,26.99 5.98,21.27 8.4,21.27 12.59,25.47 23.51,25.47 23.51,30.67 10.18,30.67 arc40 9.18,30.31 6.87,28.01
  cutout Top: 8.65,58.99 19.95,58.99 arc-183 19.83,53.79 12.34,53.79 11.7,53.15 11.7,46.04 arc-183 6.11,46.17 6.11,56.45
  cutout Top: 6,21.4 5,20.4 5,17.94 6.06,16.88 9.99,16.88 13.64,20.52 20.88,20.52 arc90 23.33,22.98 arc93 20.65,25.5 12.69,25.5 8.64,21.45 6.06,21.45 6,21.39
  cutout Bottom: 9.99,16.88 6.06,16.88 5,17.94 5,20.4 6.05,21.45 8.6,21.45 12.66,25.52 20.79,25.52 arc-90 23.33,22.98 23.33,22.85 arc-90 21.04,20.56 13.68,20.56
  cutout Bottom: 24.73,50.28 20.79,54.22 20.79,55.36 22.44,55.36 25.23,52.57 29.93,52.57 arc-90 31.08,51.42 arc-90 29.93,50.28
  cutout Bottom: 38.06,50.28 37.1,50.28 arc-97 36.16,51.34 arc-88 37.66,52.57 40.47,52.57 40.47,44.82 37.68,42.03 37.68,40.88 37.05,40.25 35.9,40.25 35.27,40.88 35.27,43.68 35.9,44.31 37.05,44.31 38.06,45.33
  cutout Top: 24.73,50.28 20.79,54.22 20.79,55.36 22.44,55.36 25.23,52.57 29.93,52.57 arc-90 31.08,51.42 arc-90 29.93,50.28
  cutout Top: 38.06,50.28 37.17,50.28 arc-90 36.16,51.3 arc-90 37.43,52.57 40.47,52.57 40.47,44.82 37.68,42.03 37.68,40.88 37.05,40.25 35.9,40.25 35.27,40.88 35.27,43.68 35.9,44.31 37.05,44.31 38.06,45.33
  cutout Top: 12.92,32.12 12.92,34.41 arc-90 14.82,36.31 14.95,36.31 arc-90 16.85,34.41 16.85,32.12 arc-90 14.95,30.21 14.82,30.21 arc-90
  cutout Bottom: 12.92,32.12 12.92,34.41 arc-90 14.82,36.31 14.95,36.31 arc-90 16.85,34.41 16.85,32.12 arc-90 14.95,30.21 14.82,30.21 arc-90
LED_DIN  (via drill 0.35)
  Top 0.305: R2.2 26.69,21.09 27.76,22.16 v29.07,22.16
  Bottom 0.305: U1.32 30.11,27.63 30.75,26.99 30.75,23.84 v29.07,22.16
LED_ON/OFF  (via drill 0.35)
  Top 0.305: R1.1 25.03,32.7 v25.67,32.07
  Bottom 0.305: v25.67,32.07 28.62,29.12 U1.1
MISO
  Bottom 0.305: U1.16 36.98,22.03 37.28,21.73 37.28,17.01 35.83,15.56 17.09,15.56 15.93,16.73 11.24,16.73 8.81,14.29 4.08,14.29 2.81,13.02 2.81,11.62 J1.1
MOSI
  Bottom 0.305: U1.15 36.27,22.62 37.04,22.62 37.81,21.84 37.81,16.84 36.02,15.05 35.83,15.05 16.95,15.05 15.74,16.27 11.43,16.27 9,13.83 8.83,13.83 J1.4
N$1
  Top 0.305: J2.3 26.02,17.85 R2.1
N$2
  Bottom 0.305: C5.2 | U1.7 33.77,30.19 33.17,30.79 29.1,30.79 28.82,31.07 R5.2 27.44,32.45 26.56,33.33 C5.2 | C5.2 26.87,35.56 27.49,35.56 Y2.3
N$3
  Bottom 0.305: C6.2 33.4,35.39 Y2.1 31.42,34.07 31.66,33.82 R5.1 32.95,32.45 33.74,31.66 33.74,31.1 34.57,30.28 U1.8
N$4
  Top 0.508: D1.A 2.91,51.48 K1.2 6.09,42.23 15.51,42.23 16.78,43.5 16.78,49.85 18.52,51.59 Q2.3
N$5
  Top 0.305: OK1.1 19.11,33.02 R1.2
N$6
  Top 0.305: 19.26,47.84 R4.2
  Top 0.508: Q2.1 19.26,47.84
N$7
  Top 0.305: R4.1 21.65,47.39
  Top 0.508: 21.65,47.39 OK1.3
N$8
  Bottom 0.305: U1.20 32.17,18.38 C10.2
N$9
  Top 3.302: K1.S 2.91,28.54 C1.+ 10.91,27.85 J2.1
  Bottom 3.302: K1.S 2.91,28.54 C1.+ 10.91,27.85 J2.1
N$11
  Top 0.305: R3.1 LED1.A
N$12
  Top 0.813: D2.C 39.26,50.87 C3.+ 39.26,45.02 L7805CV.IN
N$13  (via drill 0.35)  (1 unrouted)
  Top 0.406: v33.74,10.66 33.74,12.17 33.57,12.26
  Bottom 0.406: R7.1 34.6,10.66 v33.74,10.66
RESET  (via drill 0.35)
  Top 0.305: S2.3 34.4,15.4 33,15.4 31.95,16.45 v31.95,16.56 31.95,19.35 32.98,20.38 v32.98,22.34 33.74,22.34 34.87,23.48 R6.1 | v29.48,25.21 29.48,23.42 v30.56,22.34
  Bottom 0.305: v29.48,25.21 27.49,25.21 U1.29 | v30.56,22.34 v32.98,22.34 | v31.95,16.56 31.4,16.02 17.28,16.02 16.12,17.18 11.01,17.18 8.58,14.75 3.89,14.75 2.35,13.21 2.35,10.29 4.7,7.94 8.02,7.94 J1.5
RX_LOW
  Top 0.305: R8.1 16.58,6.01 17.01,6.44 Q1.2 17.13,6.4 18,6.4 19.26,5.14 19.26,4.43 20.3,3.4 23.23,3.4 BLUETOOTH_MODULE_CONN.4
RXI  (via drill 0.35)
  Top 0.305: R9.1 20.57,6.01 Q1.3 19.91,8.19 v20.08,8.19 | v25.67,21.91 v23.13,19.37 | v23.13,16.83 23.13,13.94 v23.22,13.85
  Bottom 0.305: U1.30 26.36,26.03 25.67,25.34 v25.67,21.91 | v23.13,19.37 v23.13,16.83 | v23.22,13.85 23.22,11.33 v20.08,8.19
SCK  (via drill 0.35)
  Top 0.305: v18.24,4.71 17.33,3.8 v14.43,3.8 | v37.67,23.23 37.67,22.23 v36.05,20.6 | v11.7,7.94 9.03,7.94 J1.3
  Bottom 0.305: v18.24,4.71 19.93,6.4 34.55,6.4 38.97,10.82 R7.2 38.97,15.46 38.27,16.16 38.27,22.03 37.67,22.63 v37.67,23.23 | v14.43,3.8 14.43,6.34 12.83,7.94 v11.7,7.94 | v36.05,20.6 35.98,20.54 U1.17
TX_LOW  (via drill 0.35)
  Top 0.305: R10.1 26.02,6.48 Q3.2 29.92,6.48 v31,5.4
  Bottom 0.305: BLUETOOTH_MODULE_CONN.5 23.29,3.4 30,3.4 31,4.4 v31,5.4
TXO  (via drill 0.35)
  Top 0.305: R11.1 31.88,6.01 Q3.3 30.45,7.98 v29.86,8.57 | v24.9,13.98 24.4,14.48 24.4,16.83 v24.46,16.89
  Bottom 0.305: v24.9,13.98 25.45,14.53 26.53,14.53 29.86,11.2 v29.86,8.57 | U1.31 25.43,26.83 24.46,25.86 v24.46,16.89